# EAGLE design Adafruit PiRTC (EAGLE 9.3.2)
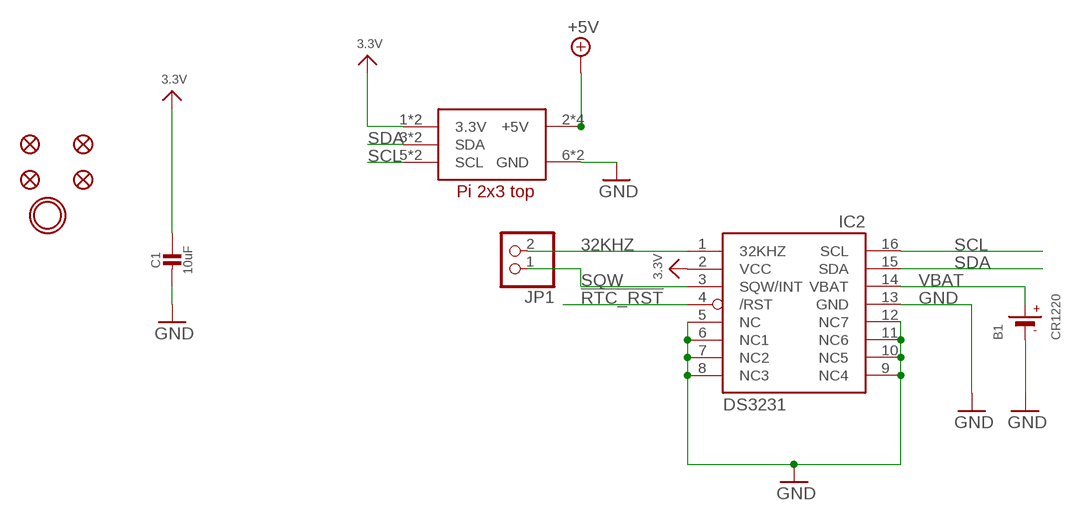
[diagram p0: schematic, sheet 1]

## Parts
B1  CR1220  BATTERYCR1220_SMT  [CR1220]
C1  10uF  CAP_CERAMIC0805-NOOUTLINE  [0805-NO]
FID1  FIDUCIAL_1MM  [FIDUCIAL_1MM]
FID2  FIDUCIAL_1MM  [FIDUCIAL_1MM]
FID3  FIDUCIAL_1MM  [FIDUCIAL_1MM]
FID4  FIDUCIAL_1MM  [FIDUCIAL_1MM]
IC2  DS3231/SO  [SO16W]
JP1  HEADER-1X2ROUND  [1X02_ROUND]
RPI1  RASPBERRYPI_2X3  [RASPBERRYPI_2X3_THMSMT]
U$4  MOUNTINGHOLE3.0THIN  [MOUNTINGHOLE_3.0_PLATEDTHIN]

## Nets
3.3V: C1.1 IC2.2(VCC) RPI1.1'(3.3V) RPI1.1(3.3V)
32KHZ: IC2.1(32KHZ) JP1.2
!RTC_RST: IC2.4(/RST)
+5V: RPI1.2'(+5V) RPI1.2(+5V) RPI1.4'(+5V) RPI1.4(+5V)
GND: B1.- C1.2 IC2.5(NC) IC2.6(NC1) IC2.7(NC2) IC2.8(NC3) IC2.9(NC4) IC2.10(NC5) IC2.11(NC6) IC2.12(NC7) IC2.13(GND) RPI1.6'(GND) RPI1.6(GND)
SCL: IC2.16(SCL) RPI1.5'(SCL) RPI1.5(SCL)
SDA: IC2.15(SDA) RPI1.3'(SDA) RPI1.3(SDA)
SQW: IC2.3(SQW/INT) JP1.1
VBAT: B1.+$1(+) B1.+$2(+) IC2.14(VBAT)

## Library data of the parts
B1 = microbuilder:BATTERY: CR1220 SMT - Digikey: 3001K-ND CD2032 BAT-HLD-001 - Digikey: BAT-HLD-001-ND
C1 = microbuilder:CAP_CERAMIC: Ceramic Capacitors For new designs, use the packages preceded by an '_' character since they are more reliable: The following footprints should be used on most boards: _0402 - Standard footprint for regular board layouts _0603 - Standard footprint for regular board layouts _0805 - Standard footprint for regular board layouts _1206 - Standard footprint for regular board layouts For extremely tight-pitch boards where space is at a premium, the following 'micro-pitch' footprints can be used (smaller pads, no silkscreen outline, etc.): _0402MP - Micro-pitch footprint for very dense/compact boards _0603MP - Micro-pitch footprint for very dense/compact boards _0805MP - Micro-pitch footprint for very dense/compact boards _1206MP - Micro-pitch footprint for very dense/compact boards
FID1-FID4 = microbuilder:FIDUCIAL: Fiducial Alignment Points Various fiducial points for machine vision alignment.; BOM: EXCLUDE
IC2 = adafruit:DS3231
JP1 = microbuilder:HEADER-1X2: PIN HEADER
RPI1 = microbuilder:RASPBERRYPI_2X3
U$4 = microbuilder:MOUNTINGHOLE: Mounting Hole For #2 screws (0.086"/2.18mm width, 0.094"/2.4mm hole) use 2.5mm; BOM: EXCLUDE

## Board
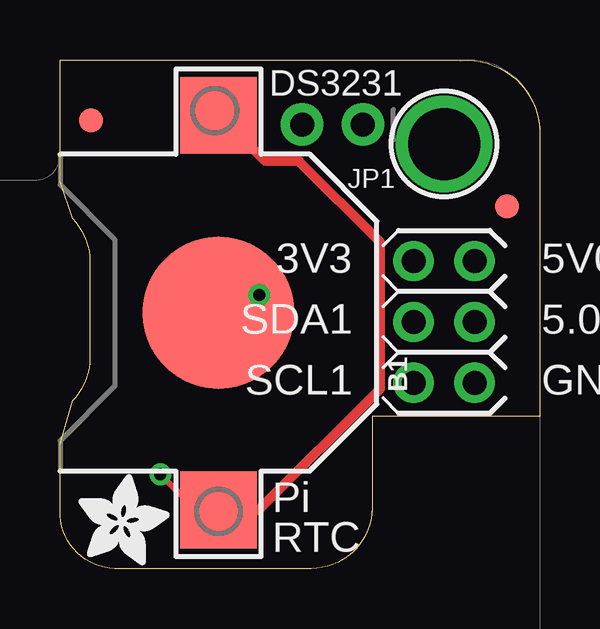
[diagram p1: board, top side]
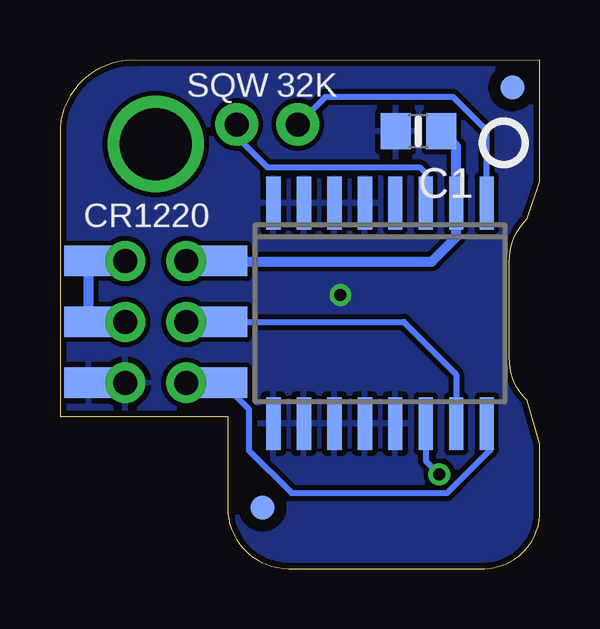
[diagram p2: board, bottom side, seen from below]

Size 19.99 x 21.21 mm. Coordinates in mm from the lower left corner, seen from the top.
Outline: 0,16.13 0,21.21 16.69,21.18 arc-90 19.99,18.39 19.99,6.35 13,6.35 13,2.54 arc-90 10.46,0 2.29,0 arc-90 0,2.41 0,5.21 0.53,7 arc45 1.27,8.8 1.27,12.79 arc45 0.53,14.59 0,16.13
Copper layers (1*16): Top 0.035mm / dielectric 1.5mm / Bottom 0.035mm
Design rules "adafruit": minimum track width 8mil, minimum drill 15.5mil, track to track 8mil, track to pad 8mil, pad to pad 8mil, via to via 8mil, smd to smd 8mil, copper to edge 10mil, drill to drill 8mil, minimum pad ring 10mil, minimum via ring 8mil, stop-mask expansion 2mil, vias tented up to drill 20mil, thermal gap 10mil

### Footprints (pad centres in the part's own frame; a part is rotated, then mirrored left to right if it is on the bottom)
CR1220 = smd 3.2 x 3.2: +$1 -8.225,0; +$2 8.225,0 | smd 6.35 x 6.35: - 0,0
0805-NO = smd 1.24 x 1.5: 1 -0.95,0; 2 0.95,0
FIDUCIAL_1MM = smd 1 x 1: 1 0,0
SO16W = smd 0.6 x 2.2: 1 -4.445,-4.6; 2 -3.175,-4.6; 3 -1.905,-4.6; 4 -0.635,-4.6; 5 0.635,-4.6; 6 1.905,-4.6; 7 3.175,-4.6; 8 4.445,-4.6; 9 4.445,4.6; 10 3.175,4.6; 11 1.905,4.6; 12 0.635,4.6; 13 -0.635,4.6; 14 -1.905,4.6; 15 -3.175,4.6; 16 -4.445,4.6
1X02_ROUND = drill 1 pad 1.778: 1 -1.27,0; 2 1.27,0
RASPBERRYPI_2X3_THMSMT = drill 1 pad 1.676: 1 -1.27,2.54; 2 1.27,2.54; 3 -1.27,0; 4 1.27,0; 5 -1.27,-2.54; 6 1.27,-2.54 | smd 2.032 x 1.27 bottom: 1' -2.794,2.54; 2' 2.794,2.54; 3' -2.794,0; 4' 2.794,0; 5' -2.794,-2.54; 6' 2.794,-2.54
MOUNTINGHOLE_3.0_PLATEDTHIN = drill 3 pad 3.6: P$1 0,0

### Placement (x,y rotation side)
B1  6.6,10.67 90 top
C1  5.05,18.24 180 bottom
FID1  1.3,18.69 180 top
FID2  18.62,15.11 180 top
FID3  11.56,2.54 0 bottom
FID4  1.14,20.07 0 bottom
IC2  6.65,10.64 180 bottom
JP1  11.35,18.52 180 top
RPI1  16,10.29 0 top
U$2  [ADAFRUIT_3.5MM]  0.76,0.13 0 top
U$3  [PCBFEAT-REV-040]  1.5,17.75 180 bottom
U$4  16,17.7 180 top

### Tracks (layer width: path | path; a pad name or v marks a point on that pad's centre or on a via)
3.3V
  Bottom 0.406: RPI1.1 RPI1.1' 12.12,12.8 4.5,12.8 3.48,13.82 IC2.2 3.48,17.61 C1.1
32KHZ
  Bottom 0.254: IC2.1 2.21,18.26 3.61,19.66 8.94,19.66 JP1.2
+5V
  Bottom 0.406: RPI1.2 RPI1.2' RPI1.4' RPI1.4
GND  (via drill 0.5)
  Top 0.254: B1.- 7.34,11.4 v8.31,11.4
  Top 0.406: B1.- 6.35,10.92
  Bottom 0.406: RPI1.6' RPI1.6
  pour Bottom: 19.68,-0.03 20.19,21.21 -0.25,21.21 -0.13,-0.03
SCL
  Bottom 0.254: RPI1.5' 12.12,6.65 12.12,4.93 10.34,3.15 3.86,3.15 2.08,4.93 2.21,5.05 IC2.16
  Bottom 0.305: RPI1.5 RPI1.5'
SDA
  Bottom 0.254: RPI1.3' 5.66,10.29 3.48,8.1 IC2.15
  Bottom 0.406: RPI1.3' RPI1.3
SQW
  Bottom 0.254: IC2.3 4.75,16.48 5,16.74 11.35,16.74 12.62,18.01 JP1.1
VBAT  (via drill 0.5)
  Top 0.254: v4.18,3.93 5.68,2.44 B1.+$1
  Top 0.406: B1.+$1 8.28,2.44 13.33,7.49 13.33,13.61 9.96,16.99 8.56,16.99 6.69,18.86 6.69,18.98 B1.+$2
  Bottom 0.254: IC2.14 4.75,4.5 v4.18,3.93

### Text on the board
tPlace: DS3231 | Pi | RTC
bPlace: 32K | SQW | CR1220